# EAGLE design PowerBoard (EAGLE 9.5.2)
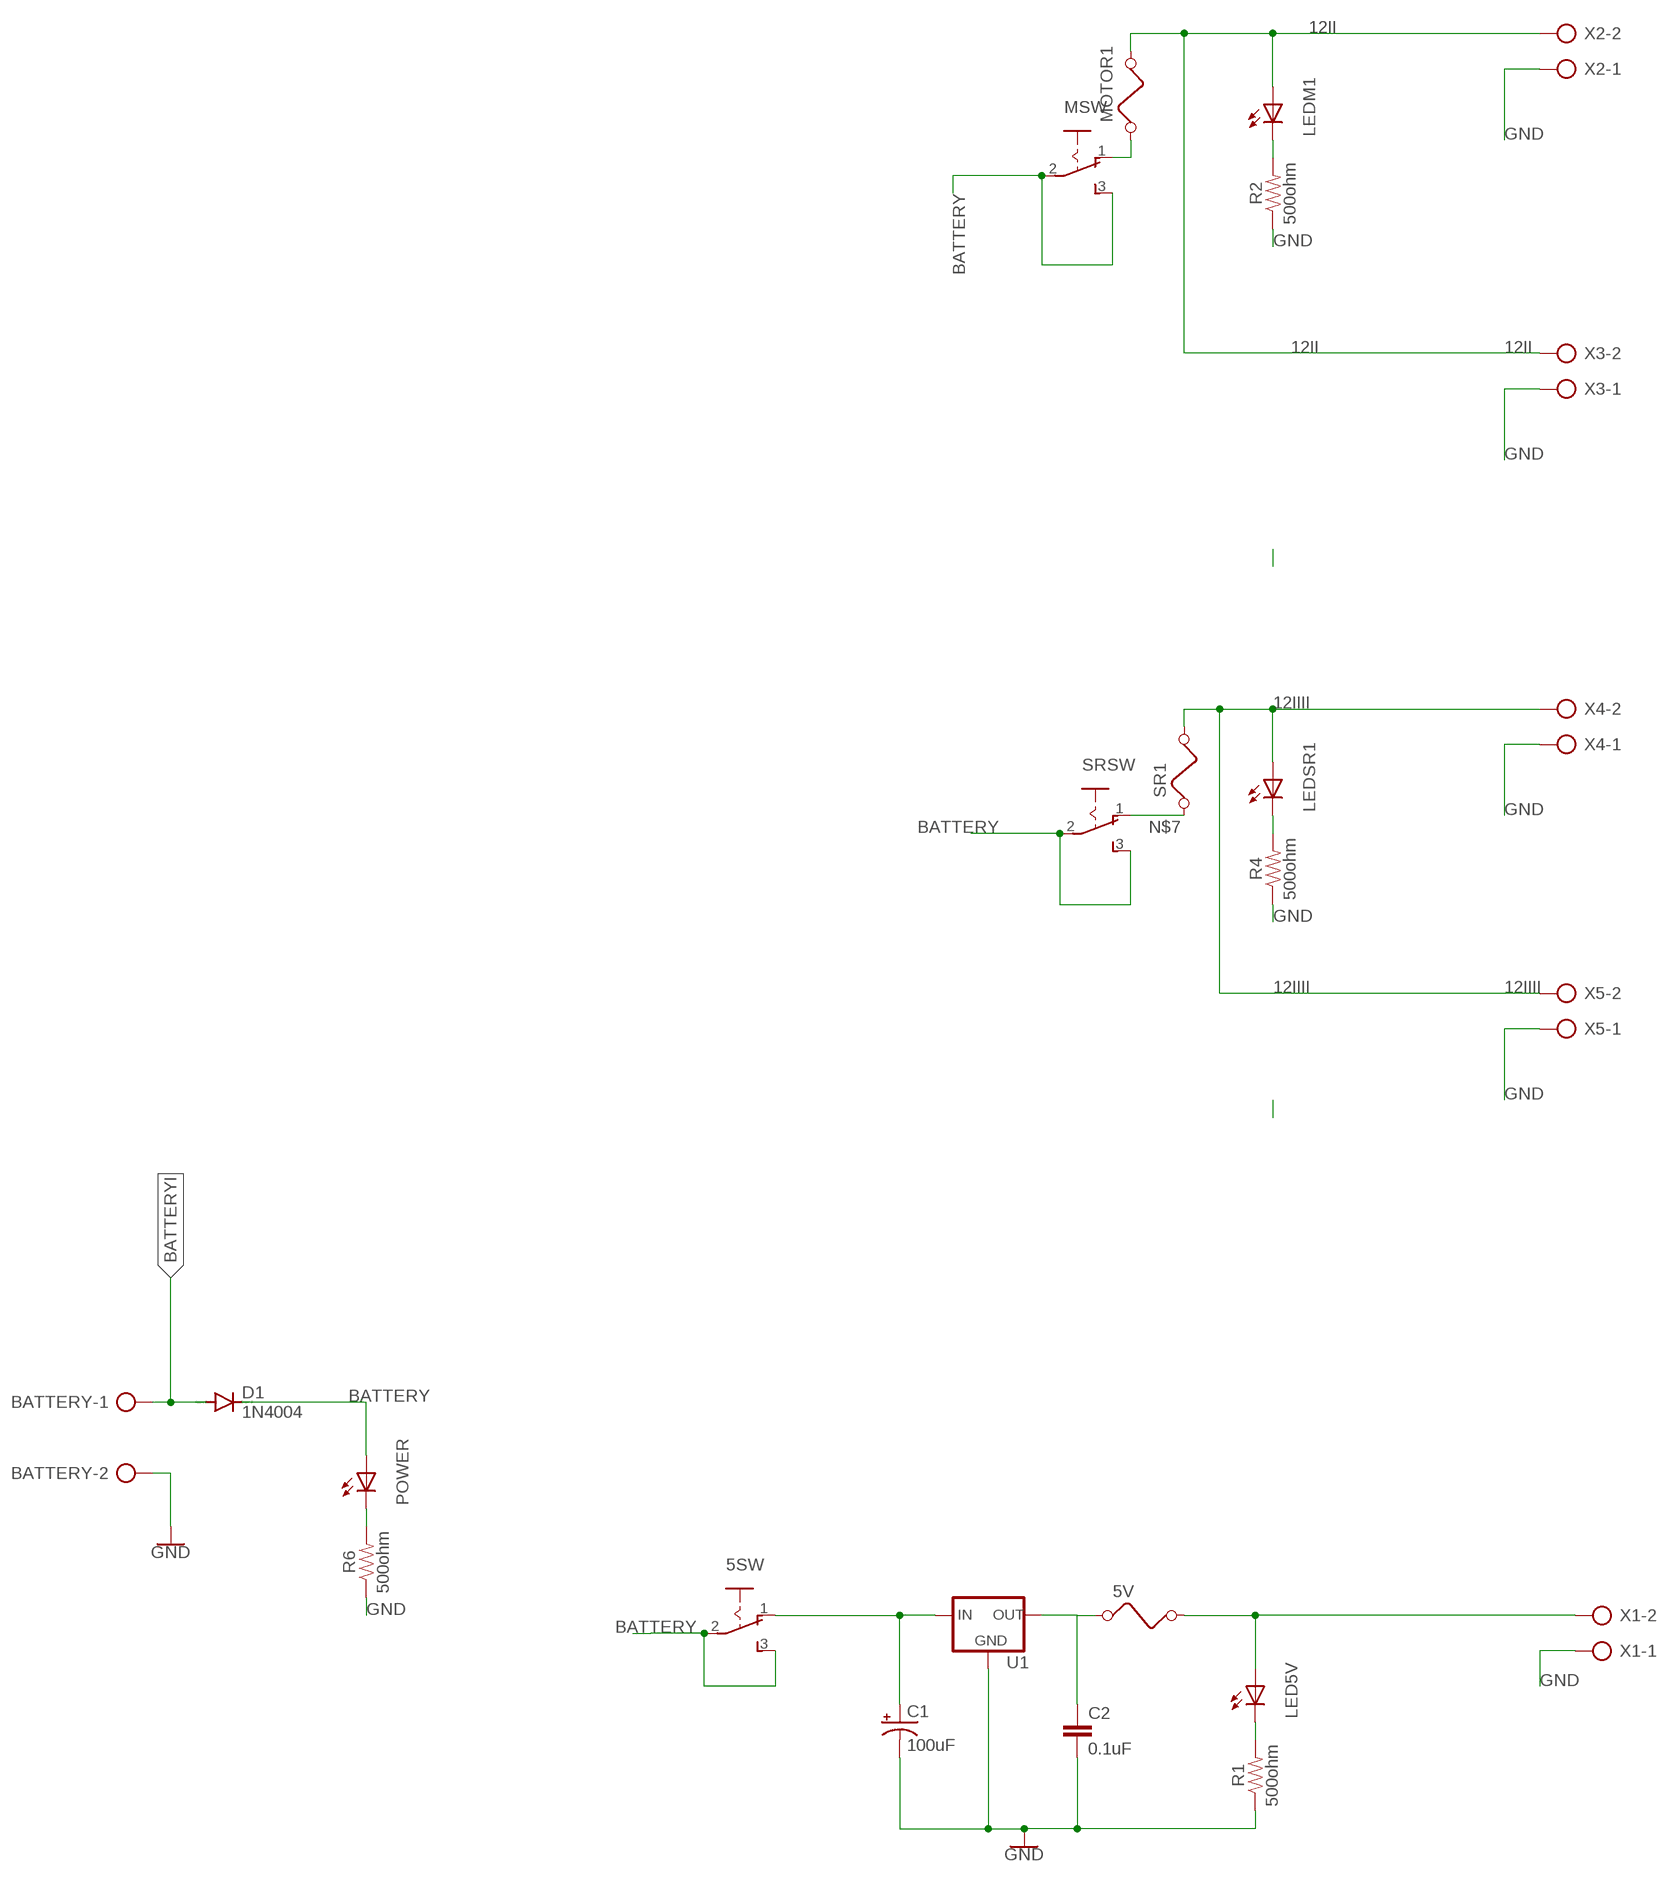
[diagram p0: schematic, sheet 1]

## Parts
5SW  255SB  [255SB]
5V  FUSE  [FUSE]
BATTERY  AK500/2-H  [AK500/2-H]
C1  100uF  100UF-POLAR-RADIAL-2.5MM-25V-20%  [CPOL-RADIAL-2.5MM-6.5MM]
C2  0.1uF  0.1UF-KIT-EZ-50V-20%  [CAP-PTH-SMALL-KIT]
D1  1N4004  [DO41-10]
LED5V  LED3MM  [LED3MM]
LEDM1  LED3MM  [LED3MM]
LEDSR1  LED3MM  [LED3MM]
MOTOR1  FUSE  [FUSE]
MSW  255SB  [255SB]
POWER  LED3MM  [LED3MM]
R1  500ohm  10MOHM-HORIZ-1/4W-5%  [AXIAL-0.3]
R2  500ohm  10MOHM-HORIZ-1/4W-5%  [AXIAL-0.3]
R4  500ohm  10MOHM-HORIZ-1/4W-5%  [AXIAL-0.3]
R6  500ohm  10MOHM-HORIZ-1/4W-5%  [AXIAL-0.3]
SR1  FUSE  [FUSE]
SRSW  255SB  [255SB]
U1  78XXS  [78XXS]
X1  AK500/2-H  [AK500/2-H]
X2  AK500/2-H  [AK500/2-H]
X3  AK500/2-H  [AK500/2-H]
X4  AK500/2-H  [AK500/2-H]
X5  AK500/2-H  [AK500/2-H]

## Nets
12II: LEDM1.A MOTOR1.2 X2.2 X3.2
12IIII: LEDSR1.A SR1.2 X4.2 X5.2
BATTERY: 5SW.2(P) 5SW.3(S) D1.C MSW.2(P) MSW.3(S) POWER.A SRSW.2(P) SRSW.3(S)
BATTERYI: BATTERY.1 D1.A
GND: BATTERY.2 C1.2(-) C2.2 R1.P$1 R2.P$1 R4.P$1 R6.P$1 U1.GND X1.1 X2.1 X3.1 X4.1 X5.1
N$2: POWER.K(C) R6.P$2
N$3: LEDM1.K(C) R2.P$2
N$4: LEDSR1.K(C) R4.P$2
N$5: LED5V.K(C) R1.P$2
N$7: SR1.1 SRSW.1(O)
N$8: MOTOR1.1 MSW.1(O)
N$9: 5V.1 C2.1 U1.OUT
N$10: 5V.2 LED5V.A X1.2
SSS: 5SW.1(O) C1.1(+) U1.IN

## Library data of the parts
5SW MSW SRSW = switch:255SB: SLIDING SWITCH Distributor Buerklin, 11G810
5V MOTOR1 SR1 = special:FUSE: FUSE 5 x 20 mm
BATTERY X1-X5 = con-ptr500:AK500/2-H: CONNECTOR Aug. 2004 / PTR Meßtechnik: Die Bezeichnung der Serie AK505 wurde geändert. Es handelt sich hierbei um AK500 in horizontaler Ausführung.; OC_FARNELL: unknown; OC_NEWARK: unknown
C1 = SparkFun-Capacitors:100UF-POLAR: 100µF polarized capacitors A capacitor is a passive two-terminal electrical component used to store electrical energy temporarily in an electric field.; PROD_ID: CAP-08439
C2 = SparkFun-Capacitors:0.1UF: 0.1µF ceramic capacitors A capacitor is a passive two-terminal electrical component used to store electrical energy temporarily in an electric field.; PROD_ID: CAP-08370
D1 = diode:1N4004: DIODE general purpose rectifier, 1 A
LED5V LEDM1 LEDSR1 POWER = led:LED: LED OSRAM: - CHIPLED LG R971, LG N971, LY N971, LG Q971, LY Q971, LO R971, LY R971 LH N974, LH R974 LS Q976, LO Q976, LY Q976 LO Q996 - Hyper CHIPLED LW Q18S LB Q993, LB Q99A, LB R99A - SideLED LS A670, LO A670, LY A670, LG A670, LP A670 LB A673, LV A673, LT A673, LW A673 LH A674 LY A675 LS A676, LA A676, LO A676, LY A676, LW A676 LS A679, LY A679, LG A679 - Hyper Micro SIDELED® LS Y876, LA Y876, LO Y876, LY Y876 LT Y87S - SmartLED LW L88C, LW L88S LB L89C, LB L89S, LG L890 LS L89K, LO L89K, LY L89K LS L896, LA L896, LO L896, LY L896 - TOPLED LS T670, LO T670, LY T670, LG T670, LP T670 LSG T670, LSP T670, LSY T670, LOP T670, LYG T670 LG T671, LOG T671, LSG T671 LB T673, LV T673, LT T673, LW T673 LH T674 LS T676, LA T676, LO T676, LY T676, LB T676, LH T676, LSB T676, LW T676 LB T67C, LV T67C, LT T67C, LS T67K, LO T67K, LY T67K, LW E67C LS E67B, LA E67B, LO E67B, LY E67B, LB E67C, LV E67C, LT E67C LW T67C LS T679, LY T679, LG T679 LS T770, LO T770, LY T770, LG T770, LP T770 LB T773, LV T773, LT T773, LW T773 LH T774 LS E675, LA E675, LY E675, LS T675 LS T776, LA T776, LO T776, LY T776, LB T776 LHGB T686 LT T68C, LB T68C - Hyper Mini TOPLED® LB M676 - Mini TOPLED Santana® LG M470 LS M47K, LO M47K, LY M47K Source: http://www.osram.convergy.de LUXEON: - LUMILED® LXK2-PW12-R00, LXK2-PW12-S00, LXK2-PW14-U00, LXK2-PW14-V00 LXK2-PM12-R00, LXK2-PM12-S00, LXK2-PM14-U00 LXK2-PE12-Q00, LXK2-PE12-R00, LXK2-PE12-S00, LXK2-PE14-T00, LXK2-PE14-U00 LXK2-PB12-K00, LXK2-PB12-L00, LXK2-PB12-M00, LXK2-PB14-N00, LXK2-PB14-P00, LXK2-PB14-Q00 LXK2-PR12-L00, LXK2-PR12-M00, LXK2-PR14-Q00, LXK2-PR14-R00 LXK2-PD12-Q00, LXK2-PD12-R00, LXK2-PD12-S00 LXK2-PH12-R00, LXK2-PH12-S00 LXK2-PL12-P00, LXK2-PL12-Q00, LXK2-PL12-R00 Source: www.luxeon.com KINGBRIGHT: KA-3528ASYC Source: www.kingbright.com
R1 R2 R4 R6 = SparkFun-Resistors:10MOHM: RES-09327; PROD_ID: RES-09327; VALUE: 10M
U1 = v-reg:78XXS: VOLTAGE REGULATOR

## Board
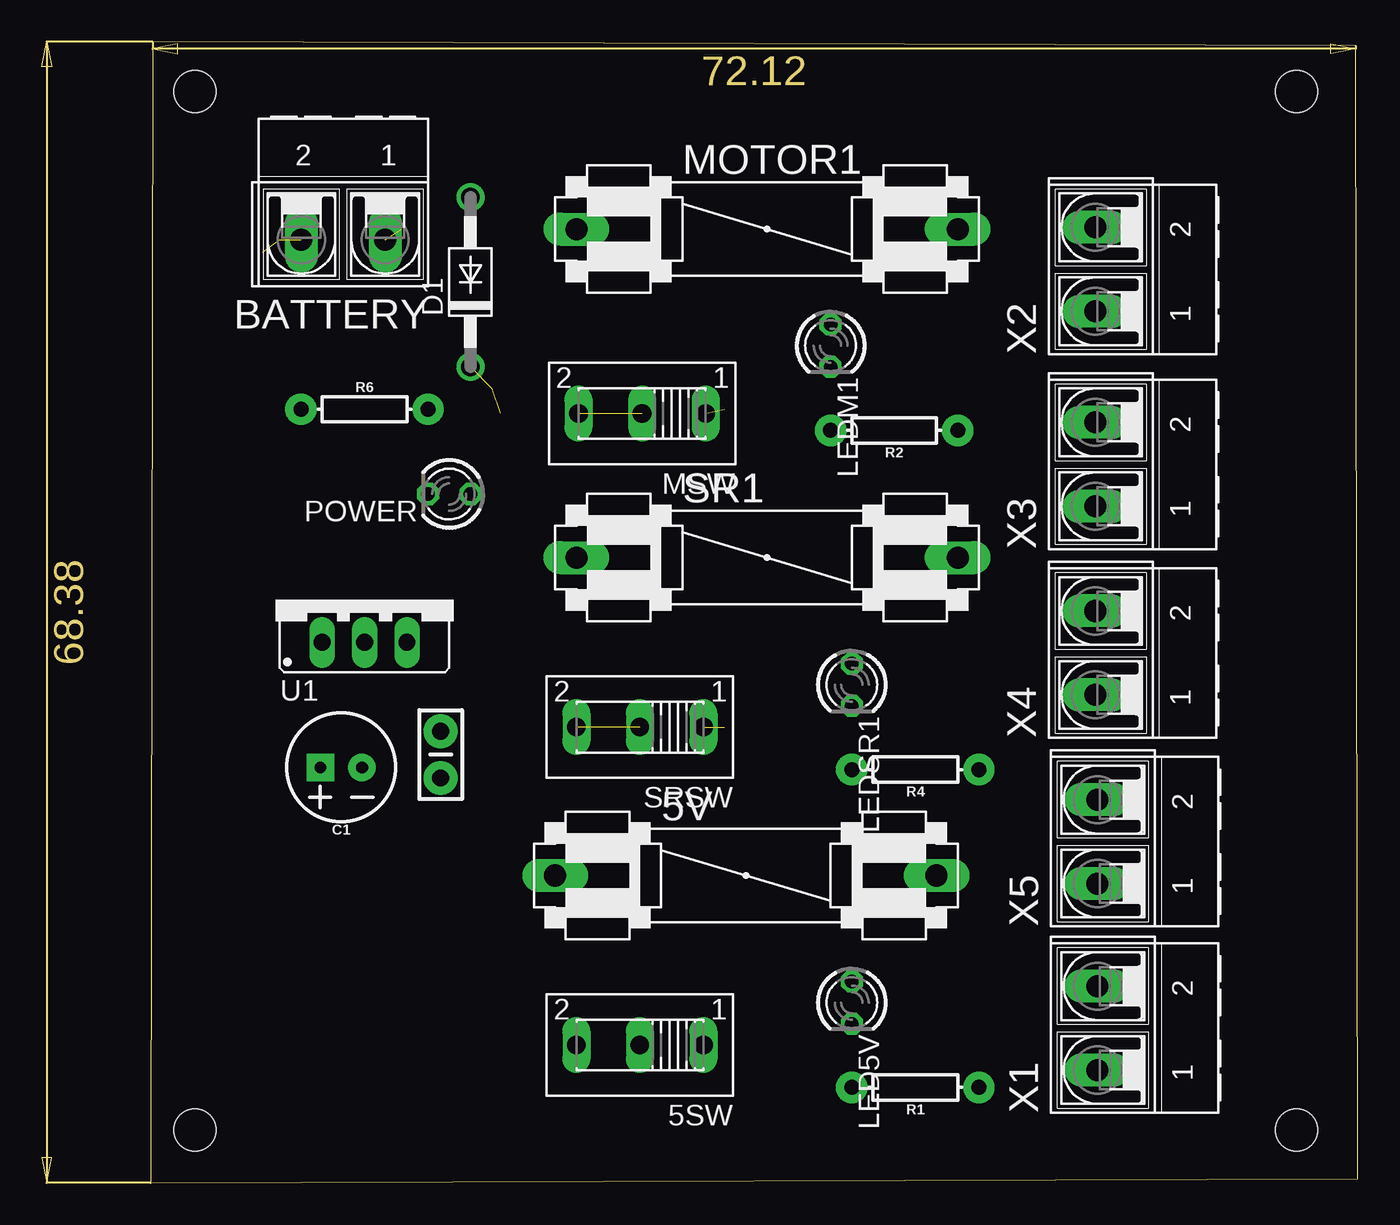
[diagram p1: board, top side]
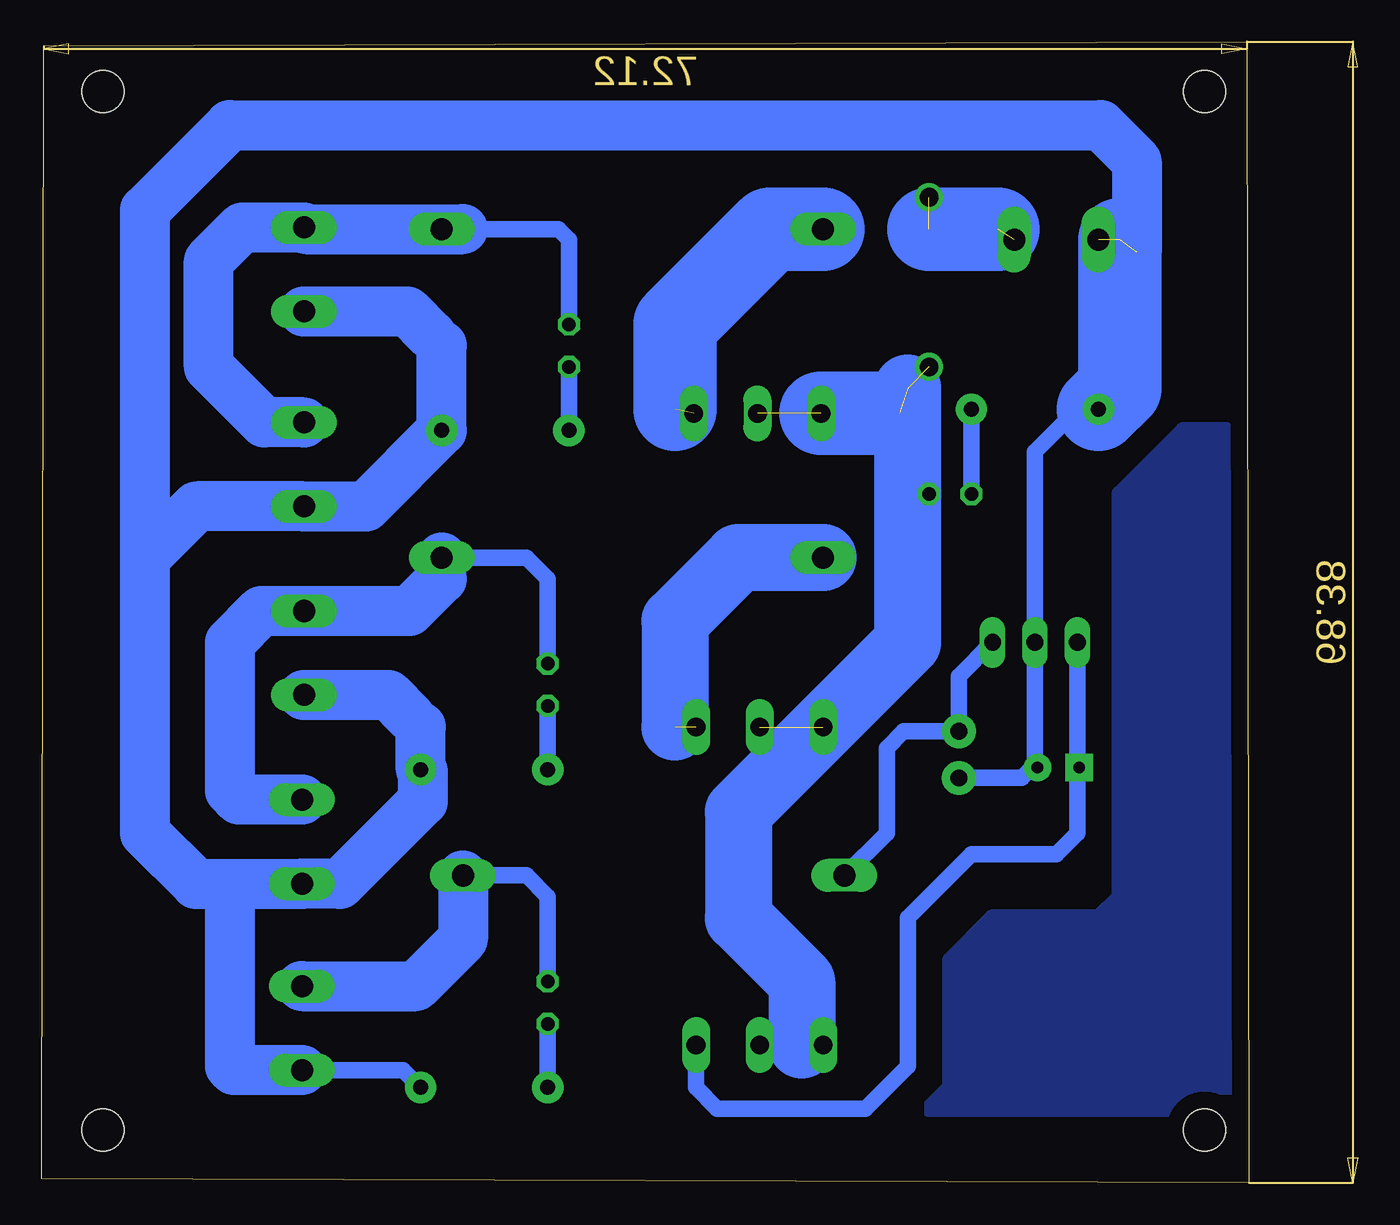
[diagram p2: board, bottom side, seen from below]

Size 72.37 x 68.38 mm. Coordinates in mm from the lower left corner, seen from the top.
Outline: 0,0 72.37,0.25 72.24,68.12 0.13,68.38 0,0
Copper layers (1*16): Top 0.035mm / dielectric 1.5mm / Bottom 0.035mm
Design rules "default": minimum track width 6mil, minimum drill 0.35mm, track to track 6mil, track to pad 6mil, pad to pad 6mil, via to via 6mil, smd to smd 6mil, copper to edge 40mil, drill to drill 6mil, minimum pad ring 10mil, minimum via ring 8mil, stop-mask expansion 4mil, vias tented up to drill 0mil, thermal gap 10mil
Holes 2.5 mm at 2.67,65.41 68.71,65.41 68.71,3.18 2.67,3.18

### Footprints (pad centres in the part's own frame; a part is rotated, then mirrored left to right if it is on the bottom)
255SB = drill 1.118 long: 1 -3.81,0; 2 0,0; 3 3.81,0
FUSE = drill 1.321 long: 1 -11.43,0; 2 11.43,0
AK500/2-H = drill 1.321 long: 1 -2.515,0; 2 2.515,0
CPOL-RADIAL-2.5MM-6.5MM = drill 0.7 pad 1.651 square: 1 1.25,0 | drill 0.7 pad 1.651: 2 -1.25,0
CAP-PTH-SMALL-KIT = drill 1.016 pad 2.032: 1 -1.397,0; 2 1.397,0
DO41-10 = drill 1.118: A 5.08,0; C -5.08,0
LED3MM = drill 0.813 octagon: A -1.27,0; K 1.27,0
AXIAL-0.3 = drill 0.9 pad 1.88: P$1 -3.81,0; P$2 3.81,0
78XXS = drill 1.016 long: GND 0,-2.54; IN -2.54,-2.54; OUT 2.54,-2.54

### Placement (x,y rotation side)
5SW  29.34,8.25 180 top
5V  35.69,18.42 0 top
BATTERY  11.56,56.52 180 top
C1  11.43,24.89 180 top
C2  17.4,25.65 270 top
D1  19.18,53.98 90 top
LED5V  42.04,10.79 270 top
LEDM1  40.77,50.17 270 top
LEDSR1  42.04,29.85 270 top
MOTOR1  36.96,57.15 0 top
MSW  29.46,46.1 180 top
POWER  17.91,41.28 180 top
R1  45.85,5.71 180 top
R2  44.58,45.09 180 top
R4  45.85,24.77 180 top
R6  12.83,46.36 0 top
SR1  36.96,37.47 0 top
SRSW  29.34,27.31 180 top
U1  12.83,34.93 0 top
X1  56.77,9.27 90 top
X2  56.64,54.74 90 top
X3  56.64,43.05 90 top
X4  56.64,31.75 90 top
X5  56.77,20.45 90 top

### Tracks (layer width: path | path; a pad name or v marks a point on that pad's centre or on a via)
12II
  Bottom 1: MOTOR1.2 47.12,57.15 41.4,57.15 40.77,56.52 LEDM1.A
  Bottom 3: 47.12,57.15 56.54,57.15 X2.2 60.35,57.25 62.36,55.25 62.36,48.9 59.03,45.57 X3.2
12IIII
  Bottom 1: LEDSR1.A 42.04,36.2 43.31,37.47 SR1.2
  Bottom 3: SR1.2 48.39,36.2 50.32,34.27 X4.2 59.21,34.27 61.09,32.39 61.09,23.5 60.55,22.96 X5.2
BATTERY  (4 unrouted)
  Bottom 1: 5SW.2 26.8,8.25 5SW.3 | POWER.A D1.C
  Bottom 4: 20.45,47.62 20.45,32.39 SRSW.3 30.61,22.23 30.61,15.88 26.8,12.07 26.8,8.25
  Bottom 5: MSW.3 20.95,46.1
BATTERYI  (2 unrouted)
  Bottom 5: 19.18,57.15 15.05,57.15
GND  (2 unrouted)
  Bottom 1: X1.1 50.7,6.76 R1.P$1 | 48.39,50.17 49.02,50.8 | 49.66,27.31 50.29,27.94 | 12.83,25.04 U1.GND 12.83,43.82 10.29,46.36 R6.P$1 | 12.83,25.04 C1.2 | C2.2 13.61,24.26 12.83,25.04
  Bottom 3: X2.1 50.44,52.22 49.02,50.8 | 48.39,50.17 R2.P$1 52.93,40.54 X3.1 63.09,40.54 66.17,37.47 | X4.1 51.59,29.24 50.29,27.94 | 49.66,27.31 R4.P$1 49.53,24.64 49.53,22.86 54.48,17.91 56.74,17.91 X5.1 56.79,17.91 60.32,17.91 | X1.1 60.86,6.76 61.09,6.99 61.09,17.14 60.32,17.91 | 66.17,37.47 66.17,20.96 63.12,17.91 60.32,17.91 | 66.17,37.47 66.17,58.29 61.09,63.37 8.89,63.37 6.73,61.21 6.73,55.75
  Bottom 5: R6.P$1 7.75,47.62 7.75,56.52
N$1
  pour Bottom: 1.4,45.09 3.94,45.09 7.75,41.28 7.75,23.5 7.75,17.14 9.02,15.88 15.37,15.88 17.91,13.34 17.91,5.71 19.18,4.45 2.67,4.45 1.4,3.18
N$2
  Bottom 1: POWER.K R6.P$2
N$3
  Bottom 1: LEDM1.K R2.P$2
N$4
  Bottom 1: R4.P$2 LEDSR1.K
N$5
  Bottom 1: R1.P$2 LED5V.K
N$7  (1 unrouted)
  Bottom 4: SR1.1 30.61,37.47 34.42,33.66 34.42,27.31
N$8  (1 unrouted)
  Bottom 5: MOTOR1.1 28.7,57.15 34.42,51.44 34.42,46.36
N$9
  Bottom 1: 5V.1 21.72,20.96 21.72,26.04 20.7,27.05 C2.1 17.4,30.35 U1.OUT
N$10
  Bottom 1: LED5V.A 42.04,17.14 43.31,18.42 5V.2
  Bottom 3: X1.2 49.94,11.79 47.12,14.61 5V.2
SSS
  Bottom 1: U1.IN 10.29,25 | 10.29,25 C1.1 | 5SW.1 33.15,5.71 31.88,4.45 22.99,4.45 20.45,6.99 20.45,15.88 16.64,19.68 11.56,19.68 10.29,20.96 10.29,25